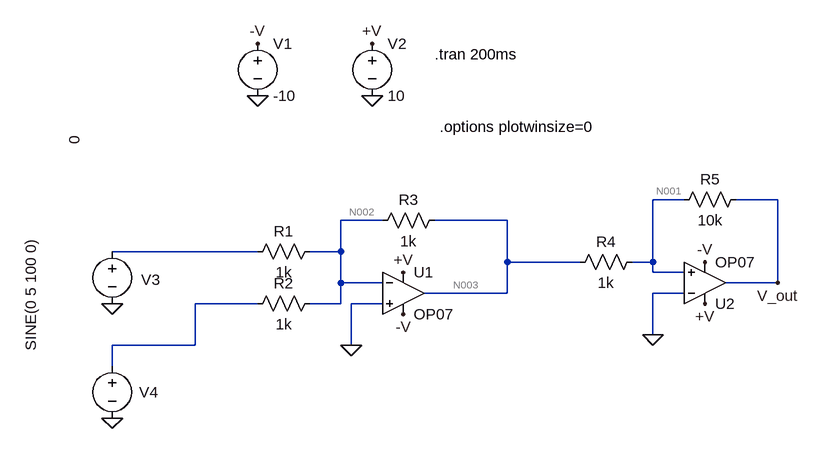
[diagram p0: schematic sch_trig_sr.asc]
sch_trig_sr.asc, the LTspice schematic file:
Version 4
SHEET 1 880 680
WIRE 320 -480 272 -480
WIRE 464 -480 400 -480
WIRE -144 -448 -208 -448
WIRE 48 -448 -64 -448
WIRE -336 -400 -560 -400
WIRE -208 -400 -208 -448
WIRE -208 -400 -256 -400
WIRE 48 -384 48 -448
WIRE 160 -384 48 -384
WIRE 272 -384 272 -480
WIRE 272 -384 240 -384
WIRE 272 -368 272 -384
WIRE 320 -368 272 -368
WIRE -208 -352 -208 -400
WIRE -144 -352 -208 -352
WIRE 464 -352 464 -480
WIRE 464 -352 384 -352
WIRE 48 -336 48 -384
WIRE 48 -336 -80 -336
WIRE 320 -336 272 -336
WIRE -336 -320 -432 -320
WIRE -208 -320 -208 -352
WIRE -208 -320 -256 -320
WIRE -144 -320 -192 -320
WIRE 272 -272 272 -336
WIRE -432 -256 -432 -320
WIRE -432 -256 -560 -256
WIRE -192 -256 -192 -320
WIRE -560 -224 -560 -256
FLAG -192 -256 0
FLAG 272 -272 0
FLAG -112 -368 +V
FLAG 352 -320 +V
FLAG 352 -384 -V
FLAG -112 -304 -V
FLAG -336 -720 -V
FLAG -160 -720 +V
FLAG -336 -640 0
FLAG -160 -640 0
FLAG -560 -144 0
FLAG -560 -320 0
FLAG 464 -352 V_out
SYMBOL OpAmps\\OP07 -112 -400 R0
SYMATTR InstName U1
SYMBOL res -240 -416 R90
WINDOW 0 0 56 VBottom 2
WINDOW 3 32 56 VTop 2
SYMATTR InstName R1
SYMATTR Value 1k
SYMBOL res -240 -336 R90
WINDOW 0 0 56 VBottom 2
WINDOW 3 32 56 VTop 2
SYMATTR InstName R2
SYMATTR Value 1k
SYMBOL res -48 -464 R90
WINDOW 0 0 56 VBottom 2
WINDOW 3 32 56 VTop 2
SYMATTR InstName R3
SYMATTR Value 1k
SYMBOL OpAmps\\OP07 352 -288 M180
SYMATTR InstName U2
SYMBOL res 256 -400 R90
WINDOW 0 0 56 VBottom 2
WINDOW 3 32 56 VTop 2
SYMATTR InstName R4
SYMATTR Value 1k
SYMBOL res 416 -496 R90
WINDOW 0 0 56 VBottom 2
WINDOW 3 32 56 VTop 2
SYMATTR InstName R5
SYMATTR Value 10k
SYMBOL voltage -336 -736 R0
WINDOW 123 0 0 Left 0
WINDOW 39 0 0 Left 0
SYMATTR InstName V1
SYMATTR Value -10
SYMBOL voltage -160 -736 R0
WINDOW 123 0 0 Left 0
WINDOW 39 0 0 Left 0
SYMATTR InstName V2
SYMATTR Value 10
SYMBOL voltage -560 -416 R0
WINDOW 0 45 59 Left 2
WINDOW 3 -58 -162 VRight 2
WINDOW 123 0 0 Left 0
WINDOW 39 0 0 Left 0
SYMATTR InstName V3
SYMATTR Value 0
SYMBOL voltage -560 -240 R0
WINDOW 0 42 56 Left 2
WINDOW 3 -125 -181 VRight 2
WINDOW 123 0 0 Left 0
WINDOW 39 0 0 Left 0
SYMATTR InstName V4
SYMATTR Value SINE(0 5 100 0)
TEXT -64 -704 Left 2 !.tran 200ms
TEXT -56 -592 Left 2 !.options plotwinsize=0

The netlist it stands for:
* sch_trig_sr.asc
XU1 0 N002 +V -V N003 LT1001  ; OP07, pins In+ In- V+ V- OUT
R1 N002 N004 1k
R2 N002 N005 1k
R3 N003 N002 1k
XU2 N001 0 +V -V V_out LT1001  ; OP07, pins In+ In- V+ V- OUT
R4 N001 N003 1k
R5 V_out N001 10k
V1 -V 0 -10
V2 +V 0 10
V3 N004 0 0
V4 N005 0 SINE(0 5 100 0)
.tran 200ms
.options plotwinsize=0
.lib LTC.lib
.backanno
.end

* Results of the author's LTspice run, read from the files saved beside the schematic
* Operating Point, zero values left out:
*   V(+v) = 10 V
*   V(-v) = -10 V
*   I(V1) = 4.5 mA
*   I(V2) = -4.5 mA
*   Ix(u1:3) = 2.25 mA
*   Ix(u1:4) = -2.25 mA
*   Ix(u2:3) = 2.25 mA
*   Ix(u2:4) = -2.25 mA
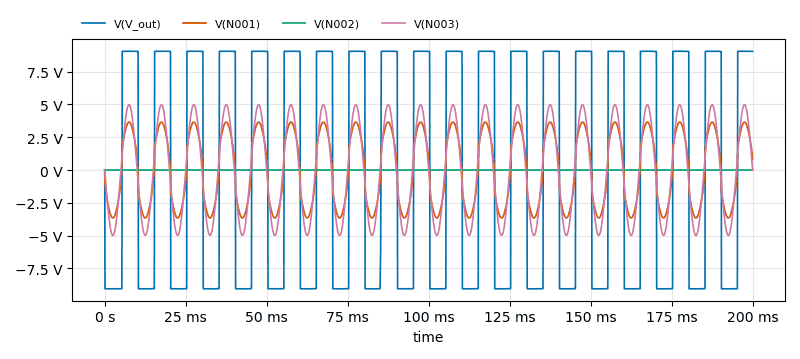
[diagram p1: Transient Analysis of sch_trig_sr.asc, plotted from the saved traces]
* Transient Analysis, 1 run:
*   V(V_out): min -9.051 V, max 9.051 V, average -20.78 mV, rms 9.003 V, last 9.041 V
*   V(N001): min -3.654 V, max 3.653 V, average -1.811 mV, rms 2.813 V, last 823.8 mV
*   V(N002): min -608.2 µV, max 609.3 µV, average 29.9 nV, rms 431 µV, last 608.8 µV
*   V(N003): min -4.987 V, max 4.986 V, average -11.7 µV, rms 3.522 V, last 1.826 mV